# EAGLE schematic breakout (EAGLE 7.1.0)

## Sheet 1 of 2
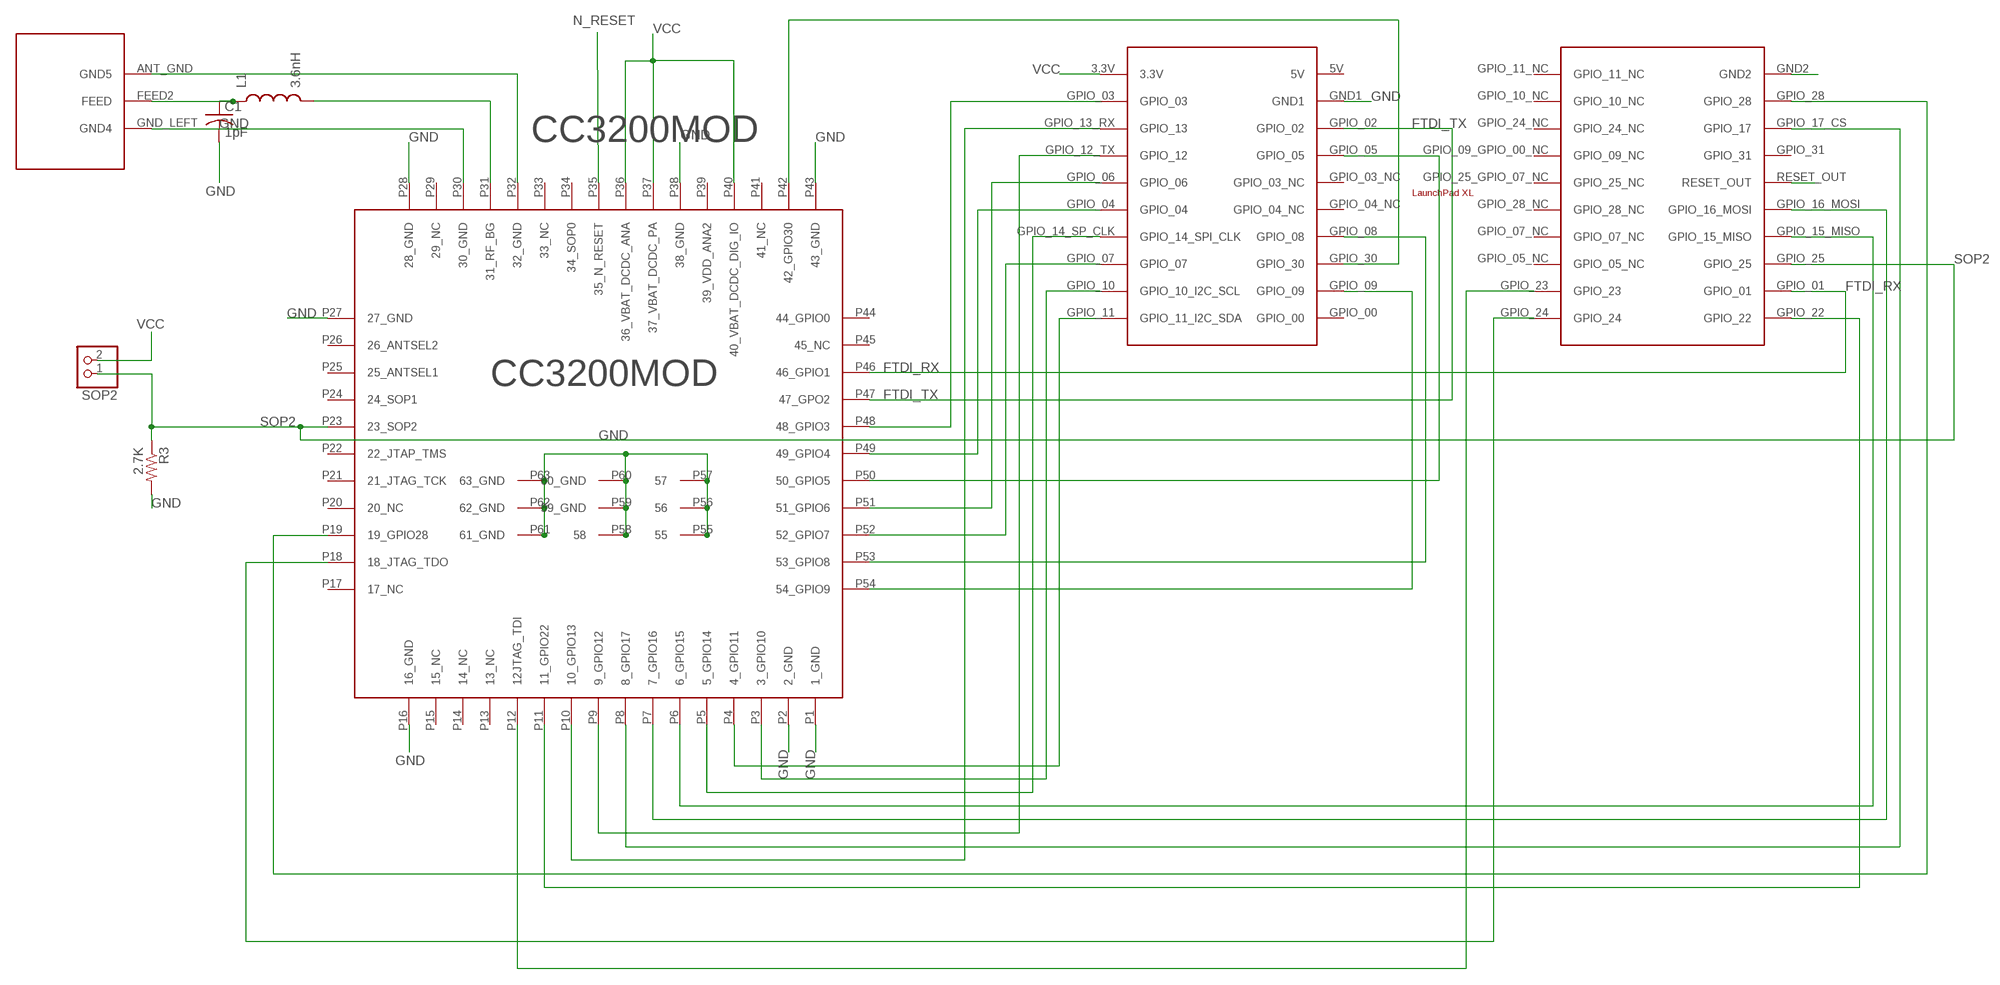
[diagram p0: schematic, sheet 1]

### Parts
ANT_PAD  ANT  [ANT]
C1  1pF  C-USC0402  [C0402]
CC3200MOD  CC3200  [CC3200MOD]
L1  3.6nH  INDUCTOR-SPARKFUN0402  [C0402]
R3  2.7K  RESISTOR0603  [0603-RES]
SOP2  PINHD-1X2  [1X02]
U11  XL  [LAUNCHPADXL]

### Nets
FTDI_RX: CC3200MOD.P46(46_GPIO1) U11.GPIO_01 ; also sheet 2
FTDI_TX: CC3200MOD.P47(47_GPO2) U11.GPIO_02 ; also sheet 2
GND: ANT_PAD.ANT_GND(GND5) ANT_PAD.GND_LEFT(GND4) C1.2 CC3200MOD.P1(1_GND) CC3200MOD.P2(2_GND) CC3200MOD.P16(16_GND) CC3200MOD.P27(27_GND) CC3200MOD.P28(28_GND) CC3200MOD.P30(30_GND) CC3200MOD.P32(32_GND) CC3200MOD.P38(38_GND) CC3200MOD.P43(43_GND) CC3200MOD.P55 CC3200MOD.P56 CC3200MOD.P57 CC3200MOD.P58 CC3200MOD.P59(59_GND) CC3200MOD.P60(60_GND) CC3200MOD.P61(61_GND) CC3200MOD.P62(62_GND) CC3200MOD.P63(63_GND) R3.2 U11.GND1 U11.GND2 ; also sheet 2
GPIO_05: CC3200MOD.P50(50_GPIO5) U11.GPIO_05 ; also sheet 2
GPIO_10: CC3200MOD.P3(3_GPIO10) U11.GPIO_10(GPIO_10_I2C_SCL) ; also sheet 2
GPIO_11: CC3200MOD.P4(4_GPIO11) U11.GPIO_11(GPIO_11_I2C_SDA) ; also sheet 2
GPIO_13: CC3200MOD.P10(10_GPIO13) U11.GPIO_13_RX(GPIO_13) ; also sheet 2
GPIO_22: CC3200MOD.P11(11_GPIO22) U11.GPIO_22
GPIO_30: CC3200MOD.P42(42_GPIO30) U11.GPIO_30 ; also sheet 2
JTAG_TDI: CC3200MOD.P12(12JTAG_TDI) U11.GPIO_23
JTAG_TDO: CC3200MOD.P18(18_JTAG_TDO) U11.GPIO_24
N$2: ANT_PAD.FEED2(FEED) C1.1 L1.1
N$3: CC3200MOD.P31(31_RF_BG) L1.2
N$8: CC3200MOD.P6(6_GPIO15) U11.GPIO_15_MISO
N$10: CC3200MOD.P7(7_GPIO16) U11.GPIO_16_MOSI
N$11: CC3200MOD.P8(8_GPIO17) U11.GPIO_17_CS(GPIO_17)
N$12: CC3200MOD.P5(5_GPIO14) U11.GPIO_14_SP_CLK(GPIO_14_SPI_CLK)
N$13: CC3200MOD.P19(19_GPIO28) U11.GPIO_28
N$18: CC3200MOD.P51(51_GPIO6) U11.GPIO_06
N$19: CC3200MOD.P49(49_GPIO4) U11.GPIO_04
N$21: CC3200MOD.P52(52_GPIO7) U11.GPIO_07
N$22: CC3200MOD.P53(53_GPIO8) U11.GPIO_08
N$23: CC3200MOD.P54(54_GPIO9) U11.GPIO_09
N$25: CC3200MOD.P9(9_GPIO12) U11.GPIO_12_TX(GPIO_12)
N$27: CC3200MOD.P48(48_GPIO3) U11.GPIO_03
N_RESET: CC3200MOD.P35(35_N_RESET) U11.RESET_OUT ; also sheet 2
SOP2: CC3200MOD.P23(23_SOP2) R3.1 SOP2.1 U11.GPIO_25 ; also sheet 2
VCC: CC3200MOD.P36(36_VBAT_DCDC_ANA) CC3200MOD.P37(37_VBAT_DCDC_PA) CC3200MOD.P40(40_VBAT_DCDC_DIG_IO) SOP2.2 U11.3.3V ; also sheet 2
Unconnected: CC3200MOD.P13(13_NC) CC3200MOD.P14(14_NC) CC3200MOD.P15(15_NC) CC3200MOD.P17(17_NC) CC3200MOD.P20(20_NC) CC3200MOD.P21(21_JTAG_TCK) CC3200MOD.P22(22_JTAP_TMS) CC3200MOD.P24(24_SOP1) CC3200MOD.P25(25_ANTSEL1) CC3200MOD.P26(26_ANTSEL2) CC3200MOD.P29(29_NC) CC3200MOD.P33(33_NC) CC3200MOD.P34(34_SOP0) CC3200MOD.P39(39_VDD_ANA2) CC3200MOD.P41(41_NC) CC3200MOD.P44(44_GPIO0) CC3200MOD.P45(45_NC) U11.5V U11.GPIO_00 U11.GPIO_03_NC U11.GPIO_04_NC U11.GPIO_05_NC U11.GPIO_07_NC U11.GPIO_09_GPIO_00_NC(GPIO_09_NC) U11.GPIO_10_NC U11.GPIO_11_NC U11.GPIO_24_NC U11.GPIO_25_GPIO_07_NC(GPIO_25_NC) U11.GPIO_28_NC U11.GPIO_31

## Sheet 2 of 2
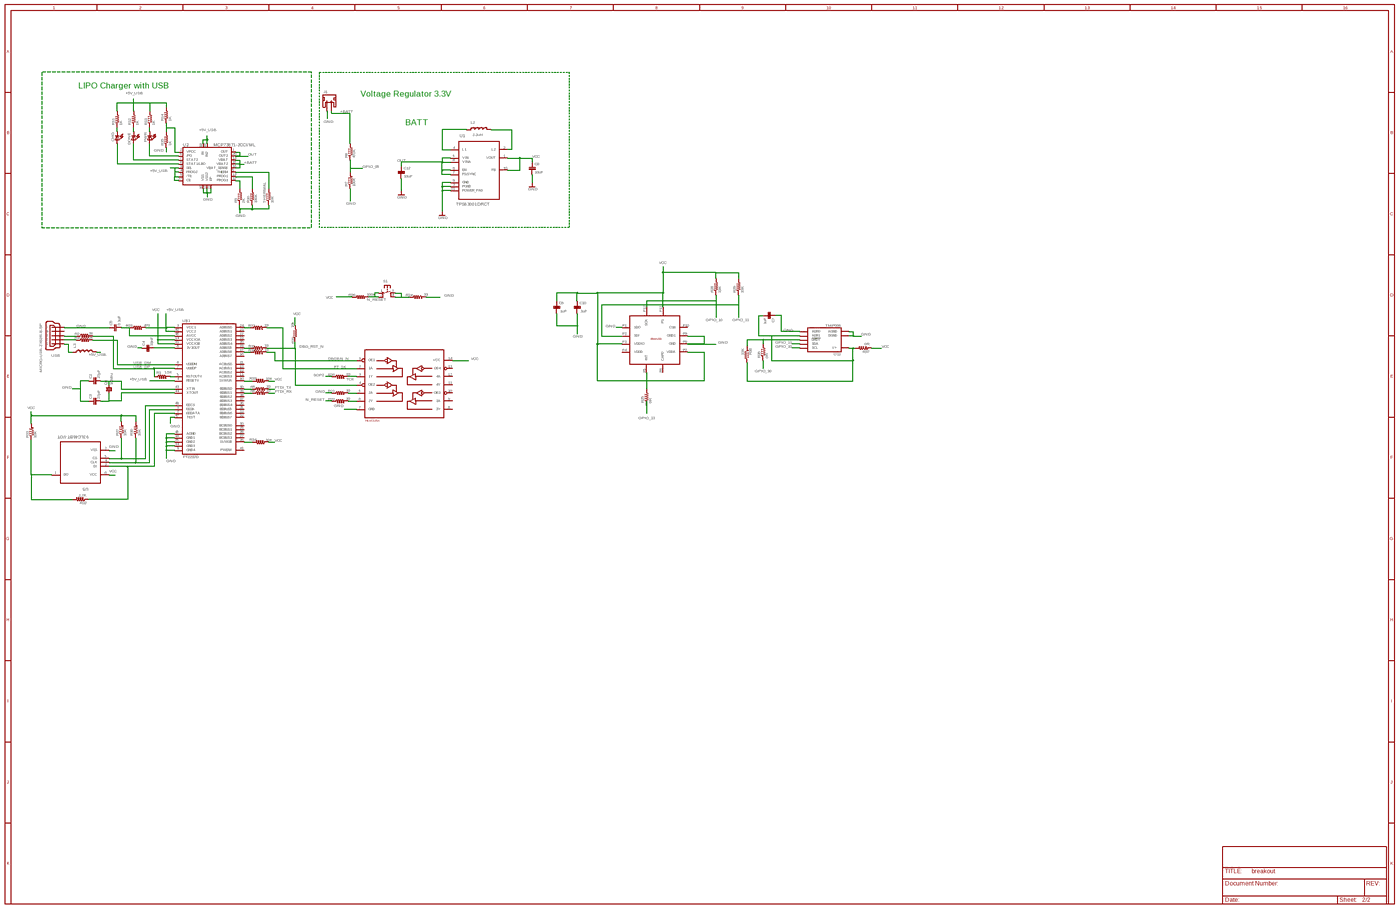
[diagram p1: schematic, sheet 2, overview]
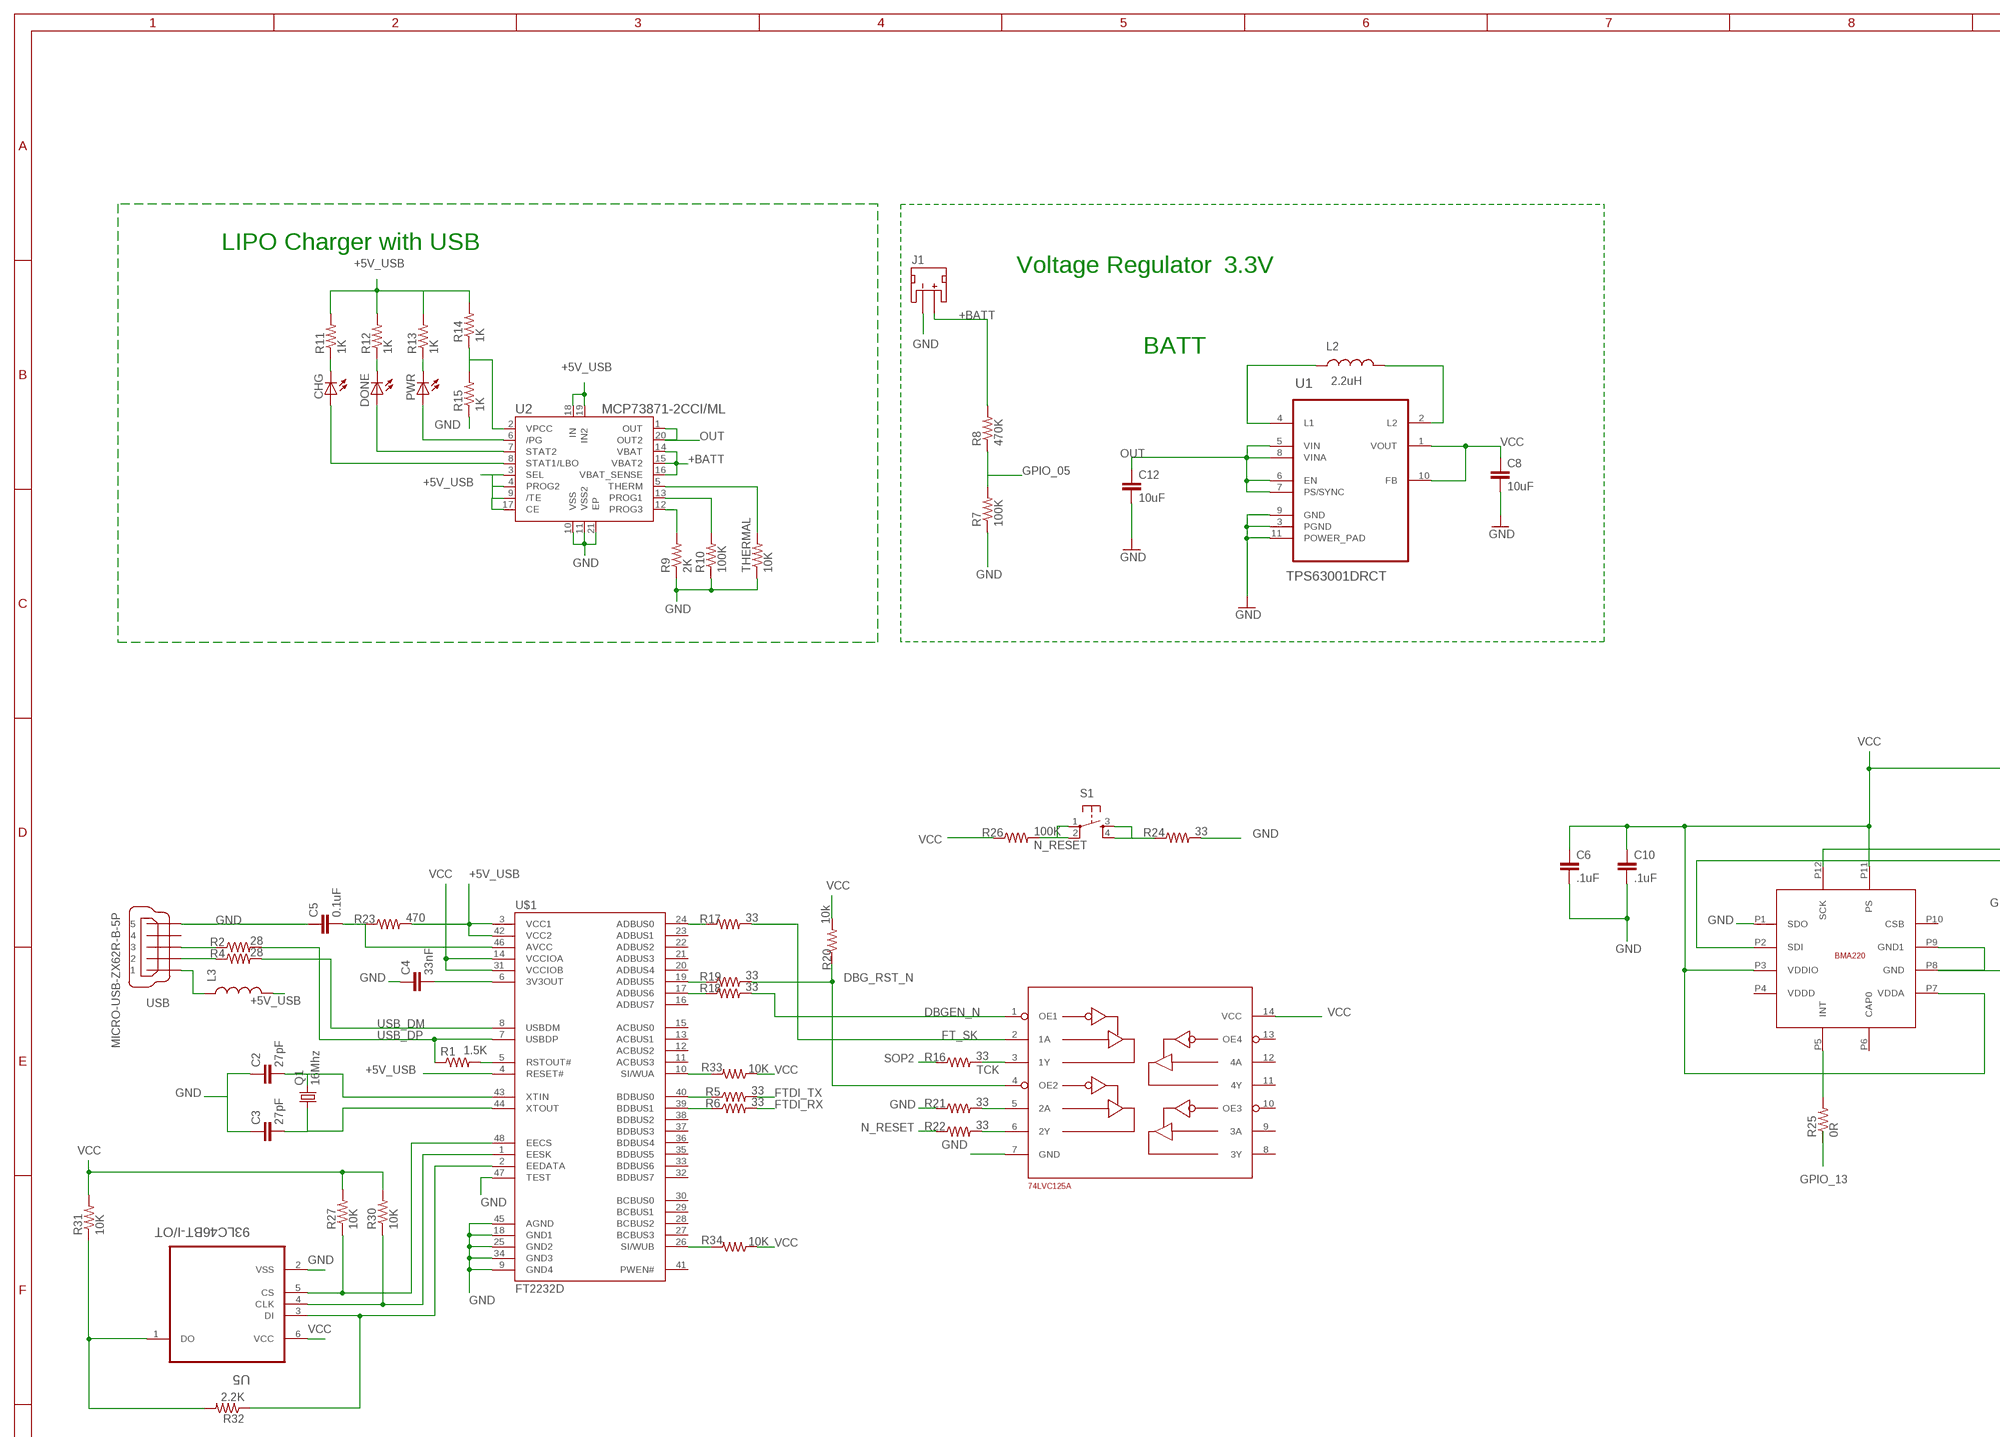
[diagram p2: schematic, sheet 2, part 1 of 4]
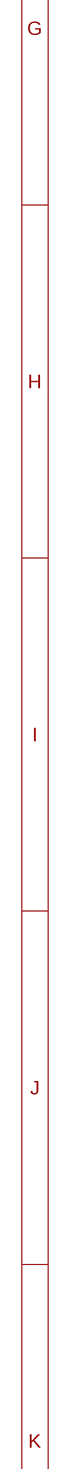
[diagram p3: schematic, sheet 2, part 2 of 4]
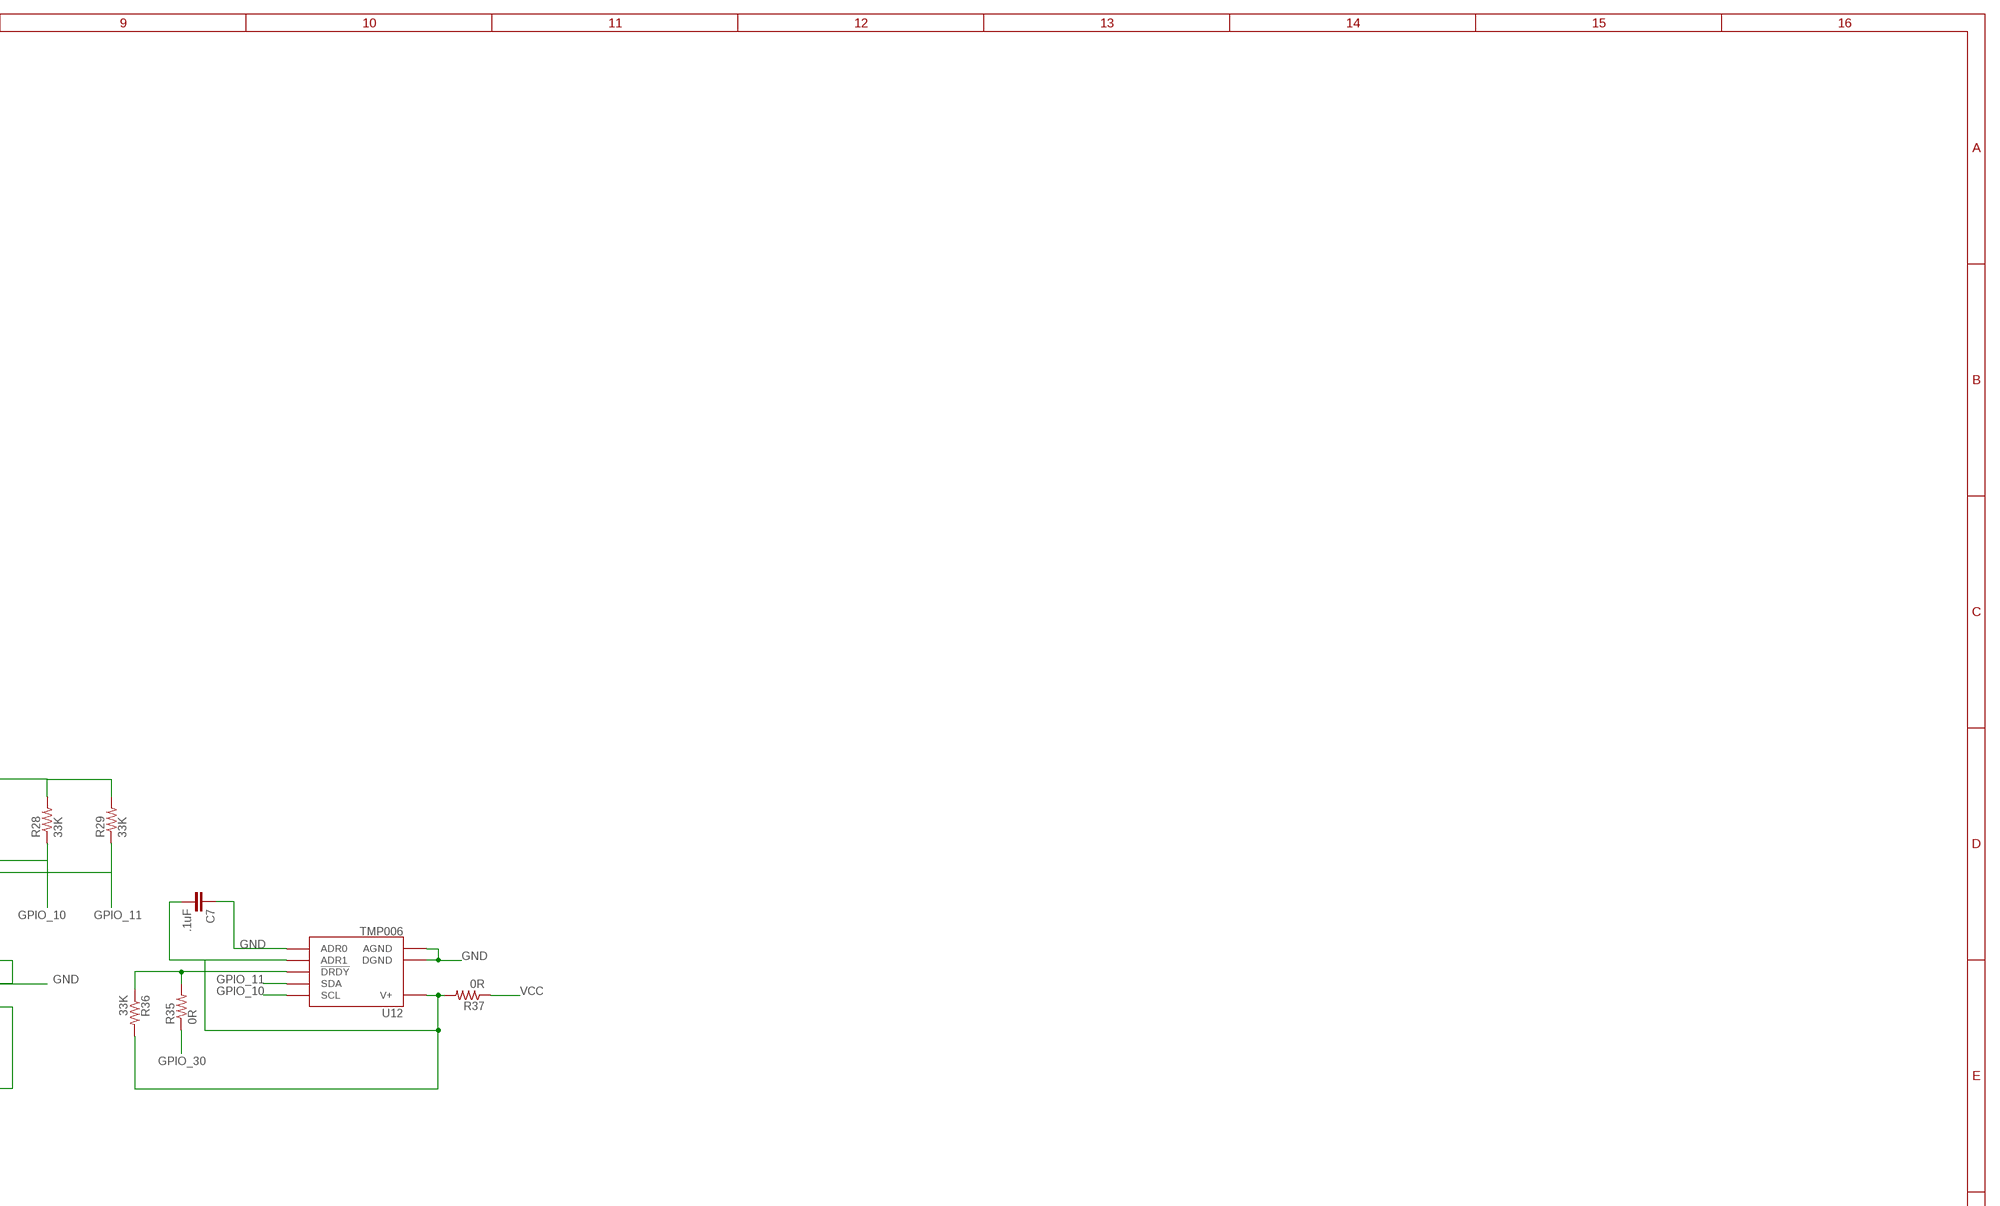
[diagram p4: schematic, sheet 2, part 3 of 4]
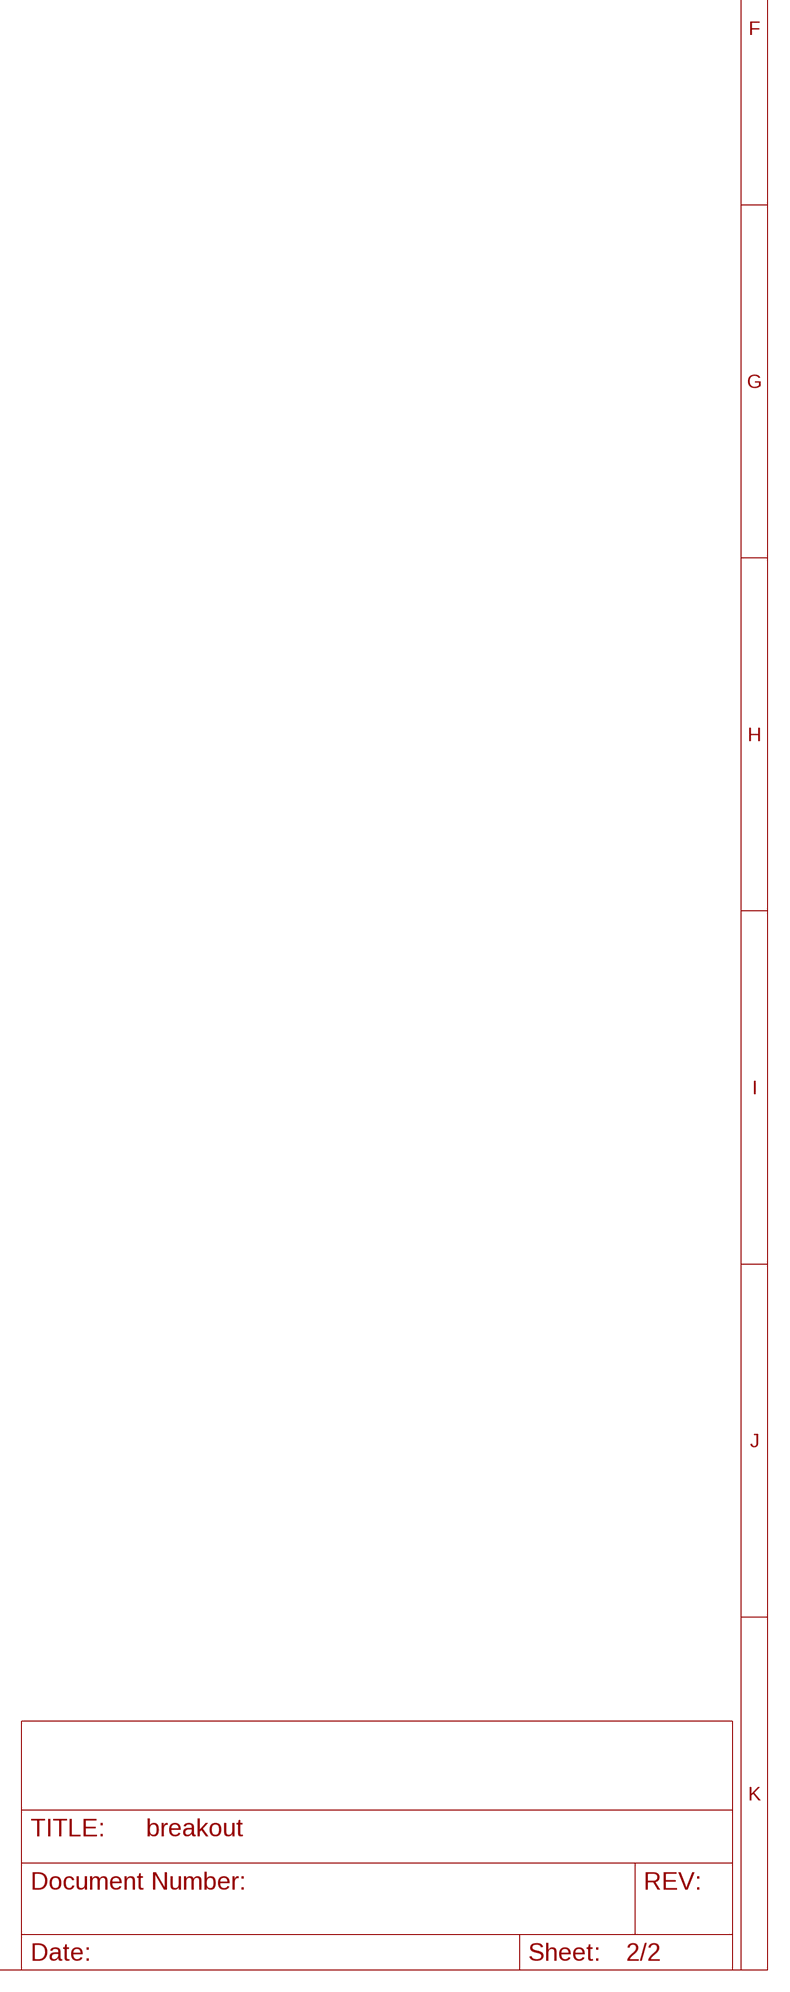
[diagram p5: schematic, sheet 2, part 4 of 4]

### Parts
C2  27pF  CAP0402-CAP  [0402-CAP]
C3  27pF  CAP0402-CAP  [0402-CAP]
C4  33nF  CAP0402-CAP  [0402-CAP]
C5  0.1uF  CAP0402-CAP  [0402-CAP]
C6  .1uF  CAP0402-CAP  [0402-CAP]
C7  .1uF  CAP0402-CAP  [0402-CAP]
C8  10uF  C-EUC0603  [C0603]
C10  .1uF  CAP0402-CAP  [0402-CAP]
C12  10uF  C-EUC0603  [C0603]
CHG  LEDSML0603  [SML0603]
DONE  LEDSML0603  [SML0603]
J1  JST_2MM_MALE  [JST-2-SMD]
L2  2.2uH  INDUCTOR0805  [0805]
L3  INDUCTOR-SPARKFUN0603  [0603]
PWR  LEDSML0603  [SML0603]
Q1  16Mhz  CRYSTALTC26H  [TC26H]
R1  1.5K  RESISTOR0603  [0603-RES]
R2  28  RESISTOR0603-RES  [0603-RES]
R4  28  RESISTOR0603-RES  [0603-RES]
R5  33  RESISTOR0603  [0603-RES]
R6  33  RESISTOR0603  [0603-RES]
R7  100K  RESISTOR0603  [0603-RES]
R8  470K  RESISTOR0603  [0603-RES]
R9  2K  RESISTOR0603-RES  [0603-RES]
R10  100K  RESISTOR0603-RES  [0603-RES]
R11  1K  RESISTOR0603-RES  [0603-RES]
R12  1K  RESISTOR0603-RES  [0603-RES]
R13  1K  RESISTOR0603-RES  [0603-RES]
R14  1K  RESISTOR0603-RES  [0603-RES]
R15  1K  RESISTOR0603-RES  [0603-RES]
R16  33  RESISTOR0603  [0603-RES]
R17  33  RESISTOR0603  [0603-RES]
R18  33  RESISTOR0603  [0603-RES]
R19  33  RESISTOR0603  [0603-RES]
R20  10k  RESISTOR0603  [0603-RES]
R21  33  RESISTOR0603  [0603-RES]
R22  33  RESISTOR0603  [0603-RES]
R23  470  RESISTOR0603  [0603-RES]
R24  33  RESISTOR0603  [0603-RES]
R25  0R  RESISTOR0603-RES  [0603-RES]
R26  100K  RESISTOR0603  [0603-RES]
R27  10K  RESISTOR0402-RES  [0402-RES]
R28  33K  RESISTOR0402-RES  [0402-RES]
R29  33K  RESISTOR0402-RES  [0402-RES]
R30  10K  RESISTOR0402-RES  [0402-RES]
R31  10K  RESISTOR0402-RES  [0402-RES]
R32  2.2K  RESISTOR0402-RES  [0402-RES]
R33  10K  RESISTOR0402-RES  [0402-RES]
R34  10K  RESISTOR0402-RES  [0402-RES]
R35  0R  RESISTOR0603-RES  [0603-RES]
R36  33K  RESISTOR0402-RES  [0402-RES]
R37  0R  RESISTOR0603-RES  [0603-RES]
S1  TAC_SWITCHSMD  [TACTILE_SWITCH_SMD]
THERMAL  10K  RESISTOR0603-RES  [0603-RES]
U1  TPS63001DRCT  [SON50P300X300X100-11N]
U2  MCP73871-2CCI/ML  [QFN20-4X4]
U5  93LC46BT-I/OT  [SOT95P280X145-6N]
U12  TMP006  [BGA8DS]
U$1  FT2232D  [LQFP-48]
U$3  DECADE-74LVC125A  [DECADE-SO-14]
U$4  BMA220  [BMA222]
USB  MICRO-USB-ZX62R-B-5P  [ZX62R-B-5P]

### Nets
+5V_USB: L3.2 R11.2 R12.2 R13.2 R14.2 R23.2 U2.3(SEL) U2.4(PROG2) U2.9(/TE) U2.17(CE) U2.18(IN) U2.19(IN2) U$1.3(VCC1) U$1.4(RESET#) U$1.42(VCC2)
+BATT: J1.2(+) R8.2 U2.14(VBAT) U2.15(VBAT2) U2.16(VBAT_SENSE)
DBG_RST_N: R19.2 R20.1 U$3.4(OE2)
DBGEN_N: R18.2 U$3.1(OE1)
FT_SK: R17.2 U$3.2(1A)
FTDI_RX: R6.2 ; also sheet 1
FTDI_TX: R5.2 ; also sheet 1
GND: C2.1 C3.1 C4.1 C5.1 C6.2 C7.1 C8.2 C10.2 C12.2 J1.1(-) R7.1 R9.1 R10.1 R15.1 R21.1 R24.2 THERMAL.1 U1.3(PGND) U1.9(GND) U1.11(POWER_PAD) U2.10(VSS) U2.11(VSS2) U2.21(EP) U5.2(VSS) U12.A1(DGND) U12.A2(AGND) U12.C1(ADR0) U$1.9(GND4) U$1.18(GND1) U$1.25(GND2) U$1.34(GND3) U$1.45(AGND) U$1.47(TEST) U$3.7(GND) U$4.P1(SDO) U$4.P8(GND) U$4.P9(GND1) USB.5 ; also sheet 1
GPIO_05: R7.2 R8.1 ; also sheet 1
GPIO_10: R28.1 U12.B3(SCL) U$4.P12(SCK) ; also sheet 1
GPIO_11: R29.1 U12.C3(SDA) U$4.P2(SDI) ; also sheet 1
GPIO_13: R25.1 ; also sheet 1
GPIO_30: R35.1 ; also sheet 1
N$7: R1.2 U$1.5(RSTOUT#)
N$14: C7.2 R36.2 R37.2 U12.A3(V+) U12.B1(ADR1)
N$15: L3.1 USB.1
N$16: R4.1 USB.2
N$17: R9.2 U2.12(PROG3)
N$20: R10.2 U2.13(PROG1)
N$24: R2.1 USB.3
N$26: PWR.A U2.6(/PG)
N$28: THERMAL.2 U2.5(THERM)
N$29: L2.1 U1.4(L1)
N$30: L2.2 U1.2(L2)
N$31: DONE.A U2.7(STAT2)
N$32: CHG.A U2.8(STAT1/LBO)
N$33: CHG.C R11.1
N$35: DONE.C R12.1
N$36: PWR.C R13.1
N$37: R14.1 R15.2 U2.2(VPCC)
N$38: C2.2 Q1.2 U$1.43(XTIN)
N$39: R27.1 U5.5(CS) U$1.48(EECS)
N$40: C3.2 Q1.1 U$1.44(XTOUT)
N$41: R30.1 U5.4(CLK) U$1.1(EESK)
N$42: R32.1 U5.3(DI) U$1.2(EEDATA)
N$43: C4.2 U$1.6(3V3OUT)
N$44: R5.1 U$1.40(BDBUS0)
N$45: R6.1 U$1.39(BDBUS1)
N$46: R17.1 U$1.24(ADBUS0)
N$47: R19.1 U$1.19(ADBUS5)
N$48: R18.1 U$1.17(ADBUS6)
N$49: R21.2 U$3.5(2A)
N$50: R22.2 U$3.6(2Y)
N$51: C5.2 R23.1 U$1.46(AVCC)
N$52: R25.2 U$4.P5(INT)
N$53: R24.1 S1.3 S1.4
N$54: R31.1 R32.2 U5.1(DO)
N$55: R33.2 U$1.10(SI/WUA)
N$56: R34.2 U$1.26(SI/WUB)
N$57: R35.2 R36.1 U12.C2(!DRDY)
N_RESET: R22.1 R26.2 S1.1 S1.2 ; also sheet 1
OUT: C12.1 U1.5(VIN) U1.6(EN) U1.7(PS/SYNC) U1.8(VINA) U2.1(OUT) U2.20(OUT2)
SOP2: R16.1 ; also sheet 1
TCK: R16.2 U$3.3(1Y)
USB_DM: R4.2 U$1.8(USBDM)
USB_DP: R1.1 R2.2 U$1.7(USBDP)
VCC: C6.1 C8.1 C10.1 R20.2 R26.1 R27.2 R28.2 R29.2 R30.2 R31.2 R33.1 R37.1 U1.1(VOUT) U1.10(FB) U5.6(VCC) U$1.14(VCCIOA) U$1.31(VCCIOB) U$3.14(VCC) U$4.P3(VDDIO) U$4.P7(VDDA) U$4.P11(PS) ; also sheet 1
Unconnected: J1.NC1(PAD1) J1.NC2(PAD2) R34.1 U$1.11(ACBUS3) U$1.12(ACBUS2) U$1.13(ACBUS1) U$1.15(ACBUS0) U$1.16(ADBUS7) U$1.20(ADBUS4) U$1.21(ADBUS3) U$1.22(ADBUS2) U$1.23(ADBUS1) U$1.27(BCBUS3) U$1.28(BCBUS2) U$1.29(BCBUS1) U$1.30(BCBUS0) U$1.32(BDBUS7) U$1.33(BDBUS6) U$1.35(BDBUS5) U$1.36(BDBUS4) U$1.37(BDBUS3) U$1.38(BDBUS2) U$1.41(PWEN#) U$3.8(3Y) U$3.9(3A) U$3.10(OE3) U$3.11(4Y) U$3.12(4A) U$3.13(OE4) U$4.P4(VDDD) U$4.P6(CAP0) U$4.P10(CSB) USB.4

### Notes on the sheet
- LIPO Charger with USB
- Voltage Regulator | 3.3V
- BATT

## Library data of the parts
ANT_PAD = Antenna:ANT
C1 = rcl:C-US: CAPACITOR, American symbol
C2-C5 = SparkFun-Passives:CAP: Capacitor Standard 0603 ceramic capacitor, and 0.1" leaded capacitor.
C6 C7 C10 = SparkFun-Capacitors:CAP: Capacitor Standard 0603 ceramic capacitor, and 0.1" leaded capacitor.
C8 C12 = rcl:C-EU: CAPACITOR, European symbol
CC3200MOD = cc3200mod:CC3200
CHG DONE PWR = led:LED: LED OSRAM: - CHIPLED LG R971, LG N971, LY N971, LG Q971, LY Q971, LO R971, LY R971 LH N974, LH R974 LS Q976, LO Q976, LY Q976 LO Q996 - Hyper CHIPLED LW Q18S LB Q993, LB Q99A, LB R99A - SideLED LS A670, LO A670, LY A670, LG A670, LP A670 LB A673, LV A673, LT A673, LW A673 LH A674 LY A675 LS A676, LA A676, LO A676, LY A676, LW A676 LS A679, LY A679, LG A679 - Hyper Micro SIDELED® LS Y876, LA Y876, LO Y876, LY Y876 LT Y87S - SmartLED LW L88C, LW L88S LB L89C, LB L89S, LG L890 LS L89K, LO L89K, LY L89K LS L896, LA L896, LO L896, LY L896 - TOPLED LS T670, LO T670, LY T670, LG T670, LP T670 LSG T670, LSP T670, LSY T670, LOP T670, LYG T670 LG T671, LOG T671, LSG T671 LB T673, LV T673, LT T673, LW T673 LH T674 LS T676, LA T676, LO T676, LY T676, LB T676, LH T676, LSB T676, LW T676 LB T67C, LV T67C, LT T67C, LS T67K, LO T67K, LY T67K, LW E67C LS E67B, LA E67B, LO E67B, LY E67B, LB E67C, LV E67C, LT E67C LW T67C LS T679, LY T679, LG T679 LS T770, LO T770, LY T770, LG T770, LP T770 LB T773, LV T773, LT T773, LW T773 LH T774 LS E675, LA E675, LY E675, LS T675 LS T776, LA T776, LO T776, LY T776, LB T776 LHGB T686 LT T68C, LB T68C - Hyper Mini TOPLED® LB M676 - Mini TOPLED Santana® LG M470 LS M47K, LO M47K, LY M47K Source: http://www.osram.convergy.de LUXEON: - LUMILED® LXK2-PW12-R00, LXK2-PW12-S00, LXK2-PW14-U00, LXK2-PW14-V00 LXK2-PM12-R00, LXK2-PM12-S00, LXK2-PM14-U00 LXK2-PE12-Q00, LXK2-PE12-R00, LXK2-PE12-S00, LXK2-PE14-T00, LXK2-PE14-U00 LXK2-PB12-K00, LXK2-PB12-L00, LXK2-PB12-M00, LXK2-PB14-N00, LXK2-PB14-P00, LXK2-PB14-Q00 LXK2-PR12-L00, LXK2-PR12-M00, LXK2-PR14-Q00, LXK2-PR14-R00 LXK2-PD12-Q00, LXK2-PD12-R00, LXK2-PD12-S00 LXK2-PH12-R00, LXK2-PH12-S00 LXK2-PL12-P00, LXK2-PL12-Q00, LXK2-PL12-R00 Source: www.luxeon.com KINGBRIGHT: KA-3528ASYC Source: www.kingbright.com
J1 = SparkFun-Connectors:JST_2MM_MALE: Mates to single-cell LiPo batteries. CONN-08352; PROD_ID: CONN-08352
L1 L3 = Spark:INDUCTOR-SPARKFUN: Inductors Basic Inductor/Choke - 0603 and 1206. Footprints are not proven and vary greatly between part numbers. SRN6045- 33uH, 20% 1.4A
L2 = SparkFun-Passives:INDUCTOR: Inductors Basic Inductor/Choke - 0603 and 1206. Footprints are not proven and vary greatly between part numbers. SRN6045- 33uH, 20% 1.4A SDR0403-560KL - 56uH, 10%, 500mA RMS/740mA peak
Q1 = crystal:CRYSTAL: CRYSTAL; OC_FARNELL: unknown; OC_NEWARK: unknown
R1 R3 R5-R8 R16-R24 R26 = SparkFun-Resistors:RESISTOR: Resistor Basic schematic elements and footprints for 0603, 1206, and PTH resistors.
R2 R4 R9-R15 R25 R27-R37 THERMAL = SparkFun-Passives:RESISTOR: Resistor Basic schematic elements and footprints for 0603, 1206, and PTH resistors.
S1 = Spark:TAC_SWITCH: SMD Tactiile Switch
SOP2 = pinhead:PINHD-1X2: PIN HEADER
U1 = TPS63001:TPS63001DRCT: HIGH EFFICIENT SINGLE INDUCTOR BUCK-BOOST CONVERTER WITH 1.8-A SWITCHES; MPN: TPS63001DRCT; OC_FARNELL: 1652399; OC_NEWARK: 22M1824; PACKAGE: SON-10; SUPPLIER: TEXAS INSTRUMENTS
U2 = microchip-battery:MCP73871: Stand-Alone System Load Sharing and Li-Ion / Li-Polymer Battery Charge Managemen The MCP73871 device is a 1A fully integrated linear solution for system load sharing and Li-Ion / Li-Polymer battery charge management with AC-DC wall adapter and USB port power sources selection. It?s also capable of autonomous power source selection between input or battery. The MCP73871 device employs a constant current/constant voltage (CC/CV) charge algorithm with selectable charge termination point. The constant voltage regulation is fixed with four available options: 4.10V, 4.20V, 4.35V, or 4.40V.; LBO: 3.1 V; SAFETYTIMER: 6 Hours; VREG: 4.20V
U5 = Microchip_By_element14_Batch_1:93LC46BT-I/OT: 1K Microwire Compatible Serial EEPROM; MPN: 93LC46BT-I/OT; OC_FARNELL: 1556164; OC_NEWARK: 75M3689; PACKAGE: SOT-6; SUPPLIER: Microchip
U11 = LaunchPadXL:XL
U12 = SparkFun-DigitalIC:TMP006
U$1 = SparkFun-DigitalIC:FT2232D: USB to USART/FIFO/JTAG/SPI/I2C
U$3 = DECADE-libraries:DECADE-74LVC125A
U$4 = bma220:BMA220: The BMA220 is an ultra small triaxial, low-g acceleration sensor with digital interfaces, aiming for low-power consumer market applications.
USB = con-hirose:MICRO-USB-: Hirose Micro USB Connector ZX62R-B-5P: Micro B, reverse (top mount) shell SMT Supplier: DigiKey H11574CT-ND Source: http://www.hirose.co.jp/cataloge_hp/e24200011.pdf